# Altium schematic sheet [6] EV 4.10.14.SchDoc
size A4; DocumentNumber: 7; SheetNumber: 7; SheetTotal: 11
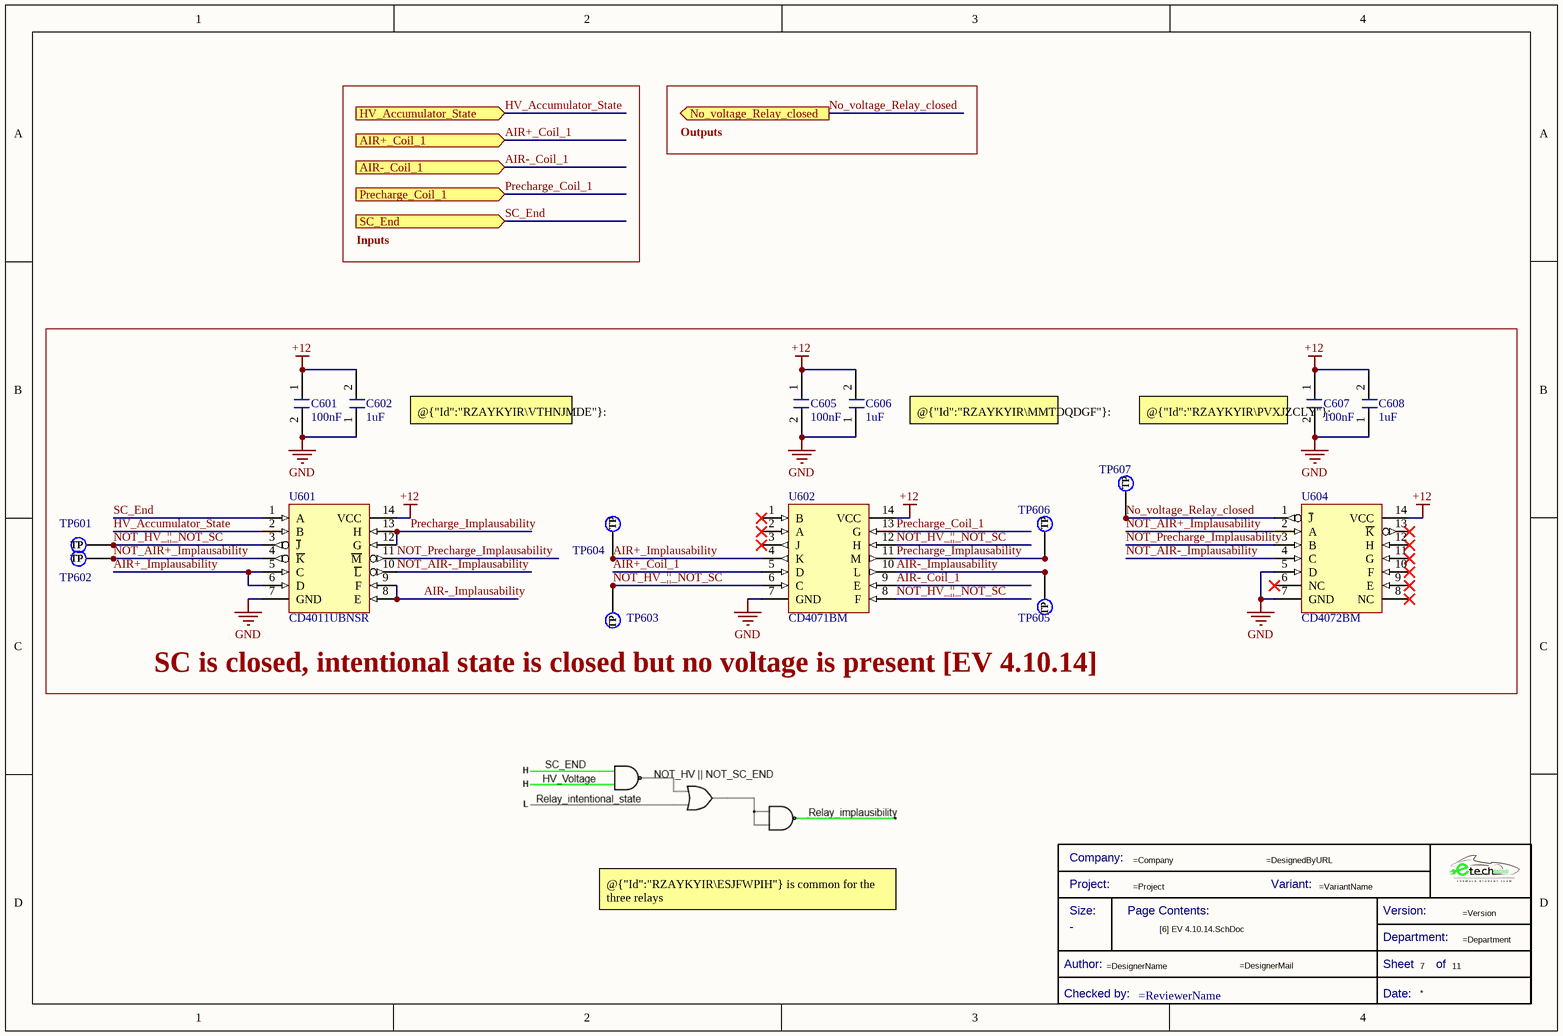
[diagram p0: [6] EV 4.10.14.SchDoc]

## Parts
*?  Title Block_template  (value not drawn)  (graphical)
C601  Capacitance: 100nF  [C0805FNPC-R]  (hidden comment: 885012207098)
C602  Capacitance: 1uF  [C0805FNPC-R]  (hidden comment: 885012207103)
C605  Capacitance: 100nF  [C0805FNPC-R]  (hidden comment: 885012207098)
C606  Capacitance: 1uF  [C0805FNPC-R]  (hidden comment: 885012207103)
C607  Capacitance: 100nF  [C0805FNPC-R]  (hidden comment: 885012207098)
C608  Capacitance: 1uF  [C0805FNPC-R]  (hidden comment: 885012207103)
TP601  TestPoint  [TestPoint]  (value not drawn)  (no BOM)
TP602  TestPoint  [TestPoint]  (value not drawn)  (no BOM)
TP603  TestPoint  [TestPoint]  (value not drawn)  (no BOM)
TP604  TestPoint  [TestPoint]  (value not drawn)  (no BOM)
TP605  TestPoint  [TestPoint]  (value not drawn)  (no BOM)
TP606  TestPoint  [TestPoint]  (value not drawn)  (no BOM)
TP607  TestPoint  [TestPoint]  (value not drawn)  (no BOM)
U601  Manufacturer Part Number: CD4011UBNSR  [ARRAY_4_NAND]  (hidden comment: CD4011UBSNR)
U602  CD4071BM  [Array_4_OR]
U604  CD4072BM  [ARRAY_4_OR]

## Ports
AIR+_Coil_1 (in), AIR-_Coil_1 (in), HV_Accumulator_State (in), No_voltage_Relay_closed (out), Precharge_Coil_1 (in), SC_End (in)

## Nets
+12: C601.1 C602.2 C605.1 C606.2 C607.1 C608.2 U601.14(VCC) U602.14(VCC) U604.14(VCC)
GND: C601.2 C602.1 C605.2 C606.1 C607.2 C608.1 U601.7(GND) U602.7(GND) U604.5(D) U604.7(GND)
AIR+_Coil_1: U602.5(D) ; port AIR+_Coil_1
AIR+_Implausability: TP604.1(TP) U601.5(C) U601.6(D) U602.4(K)
AIR-_Coil_1: U602.9(E) ; port AIR-_Coil_1
AIR-_Implausability: TP605.1(TP) U601.8(E) U601.9(F) U602.10(L)
HV_Accumulator_State: U601.2(B) ; port HV_Accumulator_State
No_voltage_Relay_closed: TP607.1(TP) U604.1(~{J}) ; port No_voltage_Relay_closed
NOT_AIR+_Implausability: TP602.1(TP) U601.4(~{K}) U604.2(A)
NOT_AIR-_Implausability: U601.10(~{L}) U604.4(C)
NOT_HV_||_NOT_SC: TP601.1(TP) TP603.1(TP) U601.3(~{J}) U602.6(C) U602.8(F) U602.12(H)
NOT_Precharge_Implausability: U601.11(~{M}) U604.3(B)
Precharge_Coil_1: U602.13(G) ; port Precharge_Coil_1
Precharge_Implausability: TP606.1(TP) U601.12(G) U601.13(H) U602.11(M)
SC_End: U601.1(A) ; port SC_End

Not connected (* = marked no-connect by the designer): U602 1(B)* 2(A)* 3(J)*; U604 6(NC)* 8(NC)* 9(E)* 10(F)* 11(G)* 12(H)* 13(~{K})*

## Notes on the sheet
- Outputs
- Inputs
- @{"Id":"RZAYKYIR\VTHNJMDE"}: 2-input NAND gate
- @{"Id":"RZAYKYIR\MMTDQDGF"}: 2-input OR gate.
- (near C607) @{"Id":"RZAYKYIR\PVXJZCLY"}: 4-input OR gate.
- SC is closed, intentional state is closed but no voltage is present [EV 4.10.14]
- @{"Id":"RZAYKYIR\ESJFWPIH"} is common for the three relays
- (in symbol Title Block_template) Company:; Project:; Variant:; Size:; Page Contents:; Version:; Department:; Author:; Sheet; of; Checked by:; Date:

## Library data of the parts
*? = Title Block_template: Standard Title Block; .Creator: GP; Category: Title Block; .PCBcheck: GP; .SCHcheck: GP; Checked by:: =ReviewerName; Size: -
C601 C605 C607 = C100n-50V-0805FNPC-X7R: Cap, 0.1ΜF, 50V, 10%, X7R, 0805; Manufacturer 1: Wurth Electronics; .Creator: DR; Supplier 1: RSComponents; Manufacturer Part Number 1: 885012207098; RoHS: Yes; Category: Ceramic Capacitors; Stock 1: 8000; Pricing 1: 100=0,10200, 500=0,07100, 2000=0,06100 (GBP); Mount: Surface Mount; Case/Package: 0805; Case Code (Metric): 2012; Case Code (Imperial): 0805; Min Operating Temperature: -55°C; Max Operating Temperature: 125°C; Packaging: Cut Tape; Voltage Rating: 50V; Dielectric: X7R; Tolerance: 10%; Voltage Rating (DC): 50V; Length: 0.079inch; Width: 0.049inch; Thickness: 0.035inch; REACH SVHC: Unknown; RoHS Compliant: Yes; ComponentLink1URL: http://www.farnell.com/datasheets/1958498.pdf?src-supplier=Farnell; ComponentLink1Description: http://www.farnell.com/datasheets/1958498.pdf?src-supplier=Farnell; ComponentLink2URL: http://www.farnell.com/datasheets/1958498.pdf?src-supplier=Element14; ComponentLink2Description: http://www.farnell.com/datasheets/1958498.pdf?src-supplier=Element14; ComponentLink3URL: https://katalog.we-online.de/pbs/datasheet/885012207098.pdf?src-supplier=Digi-Key; ComponentLink3Description: https://katalog.we-online.de/pbs/datasheet/885012207098.pdf?src-supplier=Digi-Key; ComponentLink4URL: http://www.farnell.com/datasheets/1958498.pdf?src-supplier=Newark; ComponentLink4Description: http://www.farnell.com/datasheets/1958498.pdf?src-supplier=Newark; Supplier Part Number 1: 1813493
C602 C606 C608 = C1u-50V-0805FNPC-X7R: Multilayer Ceramic Capacitor, Wcap-Csgp Series, 1 F, 10%, X7R, 50 V, 0805 [2012 Metric] Rohs Compliant: Yes; Manufacturer 1: Wurth Electronics; Voltage Rating: 50V; .Creator: GP; Supplier 1: RSComponents; Manufacturer Part Number 1: 885012207103; RoHS: Yes; Category: Ceramic Capacitors; Stock 1: 5100; Pricing 1: 50=0,27200, 250=0,25300, 500=0,22800, 1250=0,20100, 2500=0,17100 (GBP); Mount: Surface Mount; Case/Package: 0805; Case Code (Metric): 2012; Case Code (Imperial): 0805; Min Operating Temperature: -55°C; Max Operating Temperature: 85°C; Packaging: Cut Tape; Dielectric: X7R; Tolerance: 10%; Voltage Rating (DC): 50V; Length: 0.079inch; Width: 0.049inch; Thickness: 0.053inch; REACH SVHC: Unknown; RoHS Compliant: Yes; ComponentLink1URL: http://www.farnell.com/datasheets/1958501.pdf?src-supplier=Farnell; ComponentLink1Description: http://www.farnell.com/datasheets/1958501.pdf?src-supplier=Farnell; ComponentLink2URL: http://www.farnell.com/datasheets/1958501.pdf?src-supplier=Element14; ComponentLink2Description: http://www.farnell.com/datasheets/1958501.pdf?src-supplier=Element14; ComponentLink3URL: https://katalog.we-online.de/pbs/datasheet/885012107003.pdf?src-supplier=Digi-Key; ComponentLink3Description: https://katalog.we-online.de/pbs/datasheet/885012107003.pdf?src-supplier=Digi-Key; ComponentLink4URL: http://www.farnell.com/datasheets/1958501.pdf?src-supplier=Newark; ComponentLink4Description: http://www.farnell.com/datasheets/1958501.pdf?src-supplier=Newark; Supplier Part Number 1: 1813523
TP601-TP607 = TestPoint: Test Point 1x1 mm; .Creator: GP; Category: TestPoint; .PCBcheck: GP; .SCHcheck: GP
U601 = Array_4_NAND: CD4011UB Cmos Quad 2-INPUT Nand; Manufacturer: Texas Instruments; Logic Function: NAND GATE; Min Supply Voltage: 3V; Max Supply Voltage: 18V; Number of Inputs: 2; Propagation Delay: 50ns; Number of Outputs: 1; Number of Circuits: 4; Quiescent Current: 5uA; High Level Output Current: 3.4mA; Output Current: 6.8mA; Turn-On Delay Time: 120ns; .Creator: DO; Supplier 1: Digi-Key; RoHS: Yes; Category: Logic Gates; Stock 1: 964; Pricing 1: 1=0,67000, 10=0,59100, 25=0,55520, 100=0,45320, 250=0,42096, 500=0,35828, 1000=0,29575 (USD); Mount: Surface Mount; Case/Package: SOP; Number of Pins: 14; Weight: 0.007348oz; Contact Plating: Gold; Min Operating Temperature: -55°C; Max Operating Temperature: 125°C; Package Quantity: 1; Packaging: Tape and Reel; Low Level Output Current: 3.4mA; Number of Gates: 4; Number of Input Lines: 2; Number of Output Lines: 1; Number of Elements: 4; Series: 4000B; Technology: CMOS; Number of Bits: 4; Lead Free: Lead Free; RoHS Compliant: Yes; ComponentLink1URL: https://datasheet.ciiva.com/6621/cd4011ub-6621174.pdf?src-supplier=Digi-Key; ComponentLink1Description: https://datasheet.ciiva.com/6621/cd4011ub-6621174.pdf?src-supplier=Digi-Key; ComponentLink2URL: https://datasheet.ciiva.com/6621/cd4011ub-6621175.pdf?src-supplier=Digi-Key; ComponentLink2Description: https://datasheet.ciiva.com/6621/cd4011ub-6621175.pdf?src-supplier=Digi-Key; ComponentLink3URL: https://datasheet.ciiva.com/14307/cd4011ub-mil-14307943.pdf?src-supplier=Avnet; ComponentLink3Description: https://datasheet.ciiva.com/14307/cd4011ub-mil-14307943.pdf?src-supplier=Avnet; ComponentLink4URL: https://datasheet.ciiva.com/6621/cd4011ub-6621176.pdf?src-supplier=Digi-Key; ComponentLink4Description: https://datasheet.ciiva.com/6621/cd4011ub-6621176.pdf?src-supplier=Digi-Key; Supplier Part Number 1: 296-31485-1-ND; ComponentLink5Description: Where buy it; ComponentLink5URL: https://www.digikey.es/es/products/detail/texas-instruments/CD4011UBNSR/1690702?s=N4IgTCBcDaIMIBEAsAGAjGgqgIQHIGUAlAAhAF0BfIA
U602 = Array_4x2_OR: 4-ch, 2-input, 3-V to 18-V OR gates 14-SOIC -55 to 125; Manufacturer: Texas Instruments; Propagation Delay: 90ns; Max Supply Voltage: 18V; Min Supply Voltage: 3V; Number of Inputs: 2; Number of Outputs: 1; Logic Function: OR GATE; Output Current: 6.8mA; Number of Gates: 4; Low Level Output Current: 4.2mA; Quiescent Current: 5uA; High Level Output Current: -4.2mA; Input Capacitance: 5pF; Power Dissipation: 500mW; .Creator: DO; Supplier 1: Digi-Key; RoHS: Yes; Category: Logic Gates; Stock 1: 4154; Pricing 1: 1=1,26000, 10=1,12600, 25=1,06840, 100=0,87770, 250=0,82044, 500=0,72504, 1000=0,63000 (USD); Mount: Surface Mount; Case/Package: SOIC; Number of Pins: 14; Weight: 0.004564oz; Contact Plating: Gold; Min Operating Temperature: -55°C; Max Operating Temperature: 125°C; Packaging: Rail/Tube; Package Quantity: 50; Number of Input Lines: 2; Number of Output Lines: 1; Number of Circuits: 4; Number of Elements: 4; Turn-On Delay Time: 90ns; Number of Bits: 4; Radiation Hardening: No; Lead Free: Lead Free; RoHS Compliant: Yes; REACH SVHC: No SVHC; ComponentLink1URL: https://datasheet.ciiva.com/1508/1852948-1508179.pdf?src-supplier=Element14; ComponentLink1Description: https://datasheet.ciiva.com/1508/1852948-1508179.pdf?src-supplier=Element14; ComponentLink2URL: https://datasheet.ciiva.com/1866/cd4071b-1866594.pdf?src-supplier=Digi-Key; ComponentLink2Description: https://datasheet.ciiva.com/1866/cd4071b-1866594.pdf?src-supplier=Digi-Key; ComponentLink3URL: https://datasheet.ciiva.com/41455/001015512-da-01-en-ic-2-input-or-gate-cd4071bm-soic-14-tid-41455429.pdf?src-supplier=Conrad; ComponentLink3Description: https://datasheet.ciiva.com/41455/001015512-da-01-en-ic-2-input-or-gate-cd4071bm-soic-14-tid-41455429.pdf?src-supplier=Conrad; Supplier Part Number 1: 296-14278-5-ND; ComponentLink4Description: Where buy it; ComponentLink4URL: https://www.mouser.es/ProductDetail/Texas-Instruments/CD4071BM?qs=D5pVkbrsqqJ%252Bo9qTeo0l1g%3D%3D; Manufacturer Part Number: CD4071BM
U604 = Array_2x4_OR: 2-ch, 4-input, 3-V to 18-V OR gates 14-SOIC -55 to 125; Manufacturer 1: Texas Instruments; Number of Outputs: 1; Max Supply Voltage: 18V; Min Supply Voltage: 3V; Logic Function: OR GATE; Output Current: 6.8mA; Number of Inputs: 4; Propagation Delay: 90ns; Number of Circuits: 2; Quiescent Current: 5uA; High Level Output Current: -4.2mA; Low Level Output Current: 4.2mA; Turn-On Delay Time: 120ns; Schmitt Trigger Input: No; Max Power Dissipation: 500mW; Supplier 1: Digi-Key; Manufacturer Part Number 1: CD4072BM; RoHS: Yes; Category: Logic Gates; Stock 1: 3590; Pricing 1: 1=1,37000, 10=1,22900, 25=1,16640, 100=0,95810, 250=0,89564, 500=0,79150, 1000=0,62487, 2500=0,58950 (USD); Mount: Surface Mount; Case/Package: SOIC; Number of Pins: 14; Weight: 0.004564oz; Contact Plating: Gold; Min Operating Temperature: -55°C; Max Operating Temperature: 125°C; Packaging: Rail/Tube; Package Quantity: 50; Number of Gates: 2; Number of Input Lines: 4; Number of Output Lines: 1; Number of Elements: 2; Series: 4000B; Technology: CMOS; Number of Bits: 2; Power Dissipation: 500mW; Length: 8.75mm; Width: 4mm; Height: 1.5mm; Radiation Hardening: No; Lead Free: Lead Free; RoHS Compliant: Yes; Reach SVHC Compliant: Yes; ComponentLink1URL: https://datasheet.ciiva.com/1866/cd4071b-1866640.pdf?src-supplier=Digi-Key; ComponentLink1Description: https://datasheet.ciiva.com/1866/cd4071b-1866640.pdf?src-supplier=Digi-Key; ComponentLink2URL: https://datasheet.ciiva.com/15090/getdatasheetpartid-50223-15090322.pdf?src-supplier=Verical; ComponentLink2Description: https://datasheet.ciiva.com/15090/getdatasheetpartid-50223-15090322.pdf?src-supplier=Verical; ComponentLink3URL: https://datasheet.ciiva.com/1508/1847354-1508182.pdf?src-supplier=Element14; ComponentLink3Description: https://datasheet.ciiva.com/1508/1847354-1508182.pdf?src-supplier=Element14; Supplier Part Number 1: 296-25954-5-ND